# Altium project APPARATY.PrjPcb
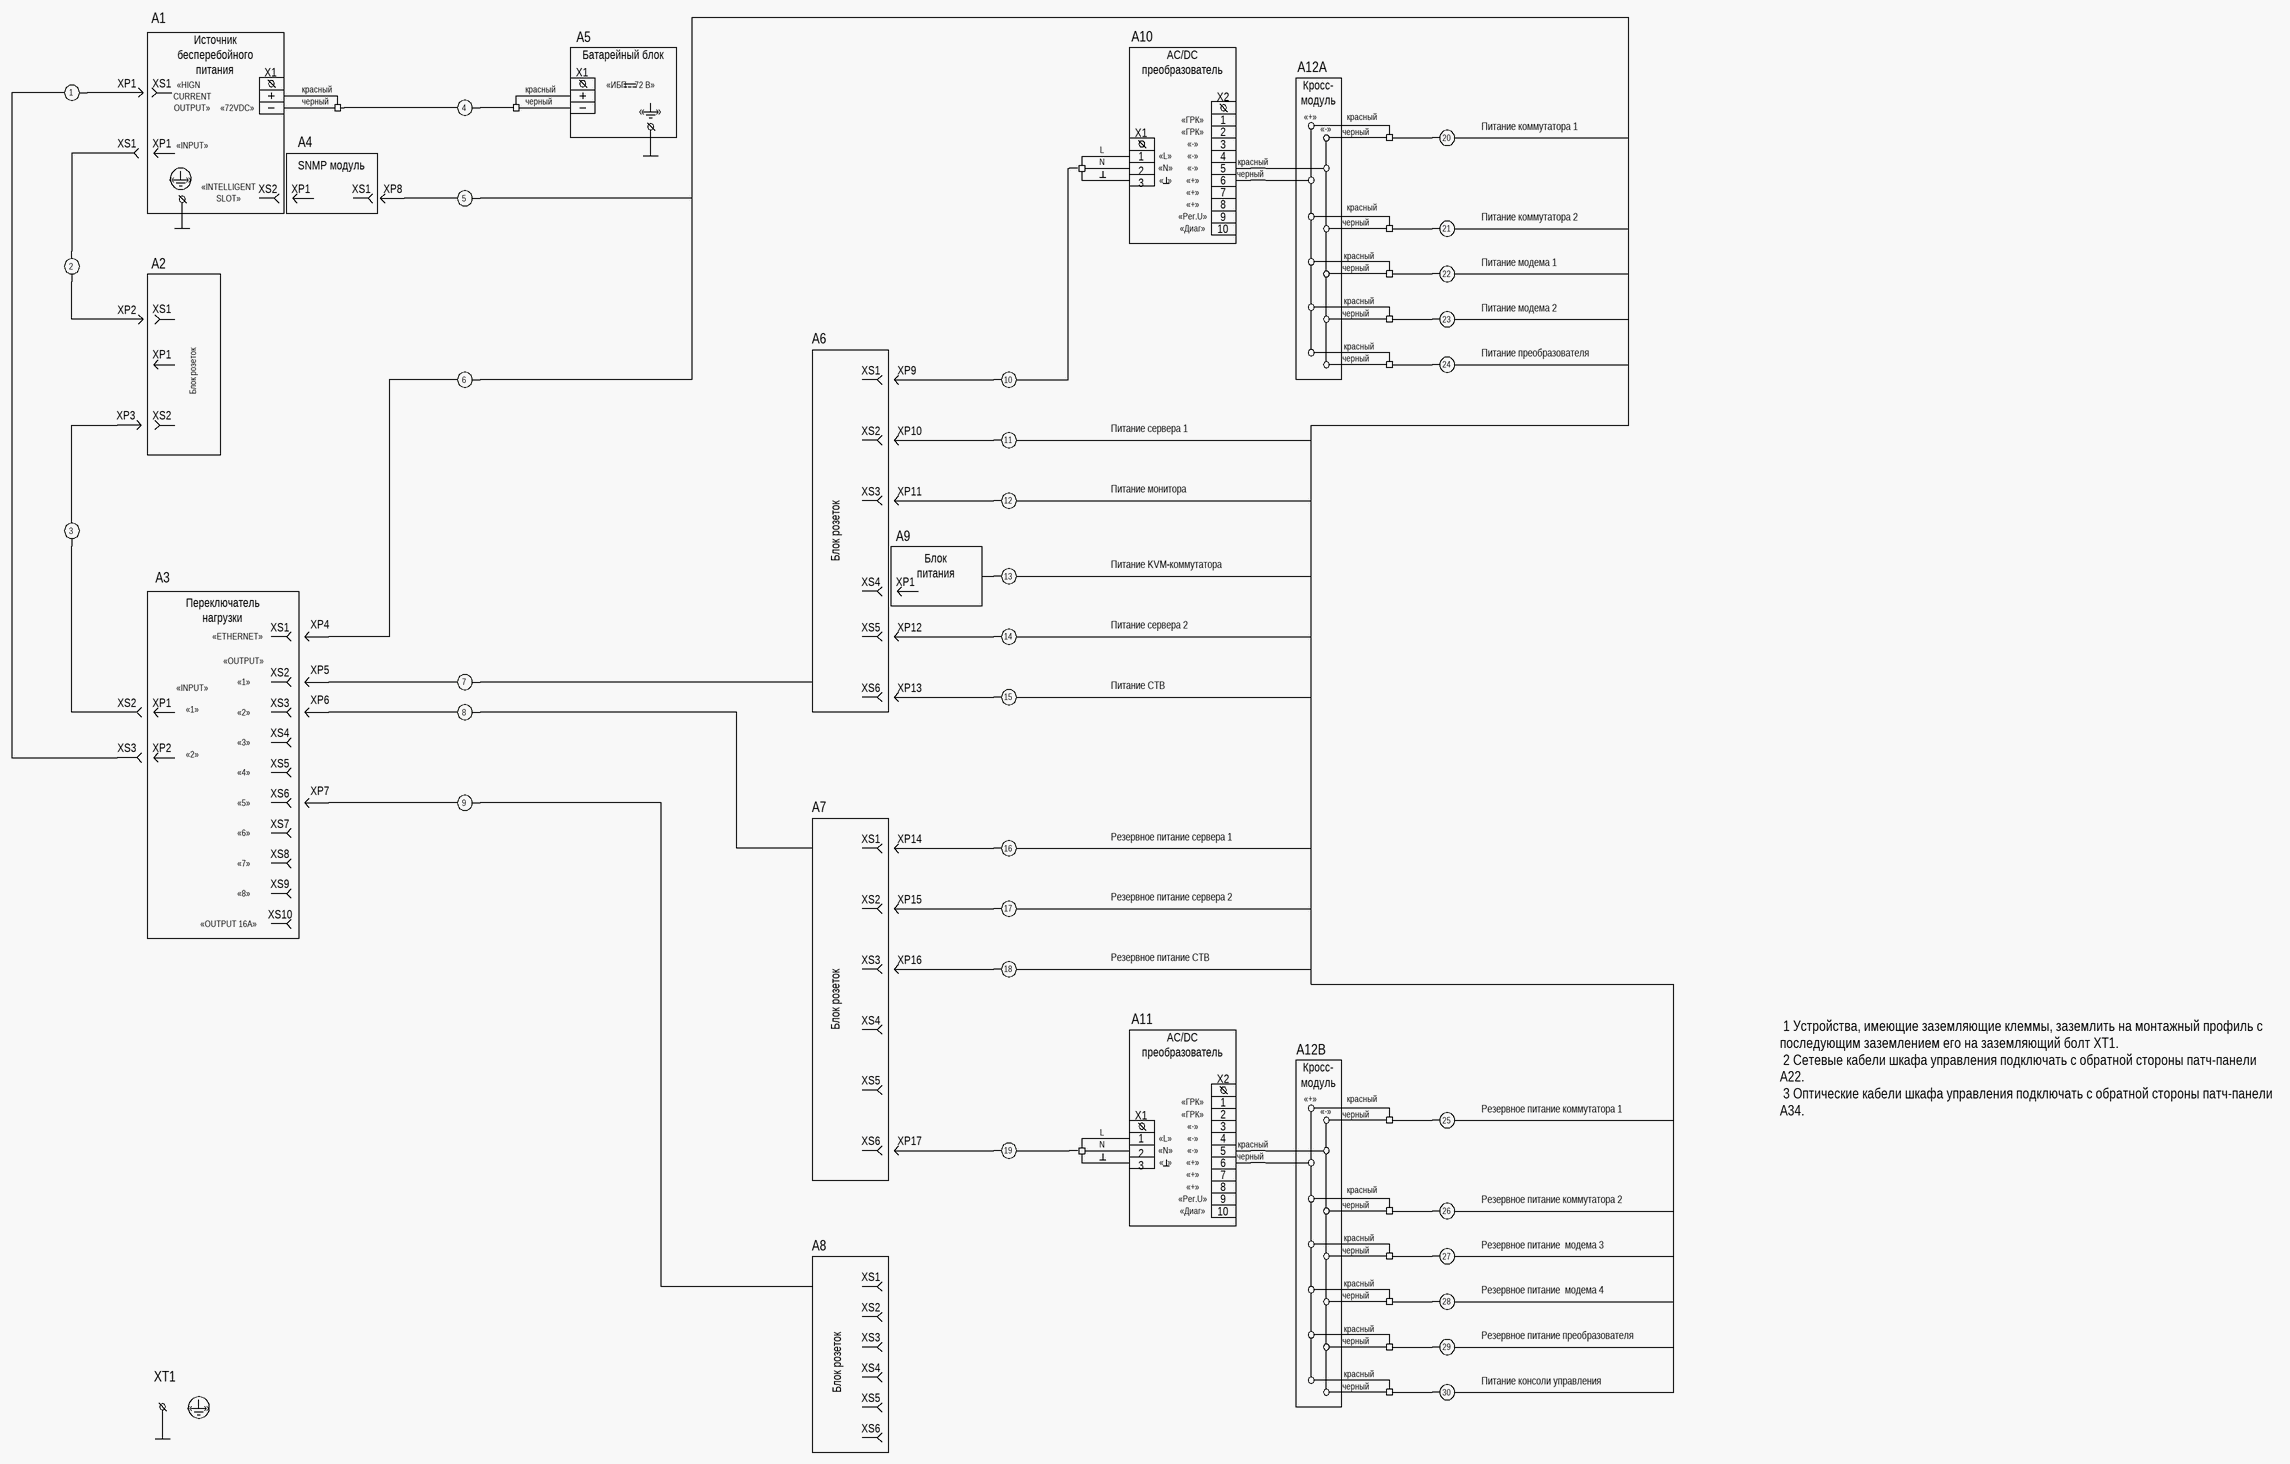
[diagram p0: Sheet1.SchDoc]
1 sheet, 63 parts. Net scope: global (net labels, ports and power ports of the same name join across sheets).

## Sheet Sheet1.SchDoc: Шкаф управления
size 840 x 594 mm; CheckedBy: Чарушин; Author: Морозов; DrawnBy: Абрамова; Engineer: Светлов; SheetNumber: 1; SheetTotal: 2; DecimalNumber: ТБИС.460800.002 Э4; Type_sh: принципиальная; Type_doc: Схема электрическая; Title2str: аппаратной (ШУА); DecimalNumber_eng: TBIS.ХХХХХХ.ХХХ; Litera: О; Primary_Applicability: Первичная применяемость

### Parts
1  CABLE  (value not drawn)
2  CABLE  (value not drawn)
3  CABLE  (value not drawn)
4  CABLE  (value not drawn)
5  CABLE  (value not drawn)
6  CABLE  (value not drawn)
7  CABLE  (value not drawn)
8  CABLE  (value not drawn)
9  CABLE  (value not drawn)
10  CABLE  (value not drawn)
11  CABLE  (value not drawn)
12  CABLE  (value not drawn)
13  CABLE  (value not drawn)
14  CABLE  (value not drawn)
15  CABLE  (value not drawn)
16  CABLE  (value not drawn)
17  CABLE  (value not drawn)
18  CABLE  (value not drawn)
19  CABLE  (value not drawn)
20  CABLE  (value not drawn)
21  CABLE  (value not drawn)
22  CABLE  (value not drawn)
23  CABLE  (value not drawn)
24  CABLE  (value not drawn)
25  CABLE  (value not drawn)
26  CABLE  (value not drawn)
27  CABLE  (value not drawn)
28  CABLE  (value not drawn)
29  CABLE  (value not drawn)
30  CABLE  (value not drawn)
A1  Источник бесперебойного питания SKAT-UPS 3000 RACK Бастион  (value not drawn)
A2  блок  (value not drawn)
A3  ПН  (value not drawn)
A4  SNMP_модуль  (value not drawn)
A5  бб  (value not drawn)
A6  БР2  (value not drawn)
A7  БР1  (value not drawn)
A8  БР3  (value not drawn)
A9  блок питания  (value not drawn)
A10  ACDC  (value not drawn)
A11  ACDC  (value not drawn)
A12  км  (value not drawn)  (parts A,B of 2)
XP1  XP  (value not drawn)
XP2  XP  (value not drawn)
XP3  XP  (value not drawn)
XP4  XP  (value not drawn)
XP5  XP  (value not drawn)
XP6  XP  (value not drawn)
XP7  XP  (value not drawn)
XP8  XP  (value not drawn)
XP9  XP  (value not drawn)
XP10  XP  (value not drawn)
XP11  XP  (value not drawn)
XP12  XP  (value not drawn)
XP13  XP  (value not drawn)
XP14  XP  (value not drawn)
XP15  XP  (value not drawn)
XP16  XP  (value not drawn)
XP17  XP  (value not drawn)
XS1  XS  (value not drawn)
XS2  XS  (value not drawn)
XS3  XS  (value not drawn)
XT1  GND  (value not drawn)

### Nets
Net1_4: 1.4(ANAIN2) XS3.6(ANAIN4)
Net1_5: 1.5(ANAIN3) XP1.6(ANAIN4)
Net2_4: 2.4(ANAIN2) XP2.6(ANAIN4)
Net2_5: 2.5(ANAIN3) XS1.6(ANAIN4)
Net3_4: 3.4(ANAIN2) XS2.6(ANAIN4)
Net3_5: 3.5(ANAIN3) XP3.6(ANAIN4)
Net4_4: 4.4(ANAIN2) A1.6(ANAIN4)
Net4_5: 4.5(ANAIN3) A5.6(ANAIN4)
Net5_4: 5.4(ANAIN2) XP8.6(ANAIN4)
Net6_4: 6.4(ANAIN2) XP4.6(ANAIN4)
Net7_4: 7.4(ANAIN2) XP5.6(ANAIN4)
Net7_5: 7.5(ANAIN3) A6.5(ANAIN3)
Net8_4: 8.4(ANAIN2) XP6.6(ANAIN4)
Net8_5: 8.5(ANAIN3) A7.5(ANAIN3)
Net9_4: 9.4(ANAIN2) XP7.6(ANAIN4)
Net9_5: 9.5(ANAIN3) A8.5(ANAIN3)
Net10_4: 10.4(ANAIN2) XP9.6(ANAIN4)
Net10_5: 10.5(ANAIN3) A10.5(ANAIN3)
Net11_4: 11.4(ANAIN2) XP10.6(ANAIN4)
Net12_4: 12.4(ANAIN2) XP11.6(ANAIN4)
Net13_4: 13.4(ANAIN2) A9.6(ANAIN4)
Net14_4: 14.4(ANAIN2) XP12.6(ANAIN4)
Net15_4: 15.4(ANAIN2) XP13.6(ANAIN4)
Net16_4: 16.4(ANAIN2) XP14.6(ANAIN4)
Net17_4: 17.4(ANAIN2) XP15.6(ANAIN4)
Net18_4: 18.4(ANAIN2) XP16.6(ANAIN4)
Net19_4: 19.4(ANAIN2) XP17.6(ANAIN4)
Net19_5: 19.5(ANAIN3) A11.5(ANAIN3)
Net20_4: 20.4(ANAIN2) A12.5(ANAIN3)
Net21_4: 21.4(ANAIN2) A12.6(ANAIN4)
Net22_4: 22.4(ANAIN2) A12.7(ANAIN5)
Net23_4: 23.4(ANAIN2) A12.8(ANAIN6)
Net24_4: 24.4(ANAIN2) A12.9(ANAIN7)
Net25_4: 25.4(ANAIN2) A12.5(ANAIN3)
Net26_4: 26.4(ANAIN2) A12.6(ANAIN4)
Net27_4: 27.4(ANAIN2) A12.7(ANAIN5)
Net28_4: 28.4(ANAIN2) A12.8(ANAIN6)
Net29_4: 29.4(ANAIN2) A12.9(ANAIN7)
Net30_4: 30.4(ANAIN2) A12.10(ANAIN8)
NetA10_6: A10.6(ANAIN4) A12.8(ANAIN6)
NetA10_7: A10.7(ANAIN5) A12.7(ANAIN5)
NetA11_6: A11.6(ANAIN4) A12.8(ANAIN6)
NetA11_7: A11.7(ANAIN5) A12.7(ANAIN5)

Not connected (* = marked no-connect by the designer): 5 5(ANAIN3); 6 5(ANAIN3); 11 5(ANAIN3); 12 5(ANAIN3); 13 5(ANAIN3); 14 5(ANAIN3); 15 5(ANAIN3); 16 5(ANAIN3); 17 5(ANAIN3); 18 5(ANAIN3); 20 5(ANAIN3); 21 5(ANAIN3); 22 5(ANAIN3); 23 5(ANAIN3); 24 5(ANAIN3); 25 5(ANAIN3); 26 5(ANAIN3); 27 5(ANAIN3); 28 5(ANAIN3); 29 5(ANAIN3); 30 5(ANAIN3)

### Notes on the sheet
- 1 Устройства, имеющие заземляющие клеммы, заземлить на монтажный профиль с последующим заземлением его на заземляющий болт XT1.
  2 Сетевые кабели шкафа управления подключать с обратной стороны патч-панели A22.
  3 Оптические кабели шкафа управления подключать с обратной стороны патч-панели A34.
- Labels drawn without touching a wire or pin: =DecimalNumber, Питание KVM-коммутатора, Питание коммутатора 1, Питание коммутатора 2, Питание консоли управления, Питание модема 1, Питание модема 2, Питание монитора, Питание преобразователя, Питание сервера 1, Питание сервера 2, Питание СТВ, Резервное питание  модема 3, Резервное питание  модема 4, Резервное питание коммутатора 1, Резервное питание коммутатора 2, Резервное питание преобразователя, Резервное питание сервера 1, Резервное питание сервера 2, Резервное питание СТВ
- Перв. примен.
- Справ. №
- Подпись и дата
- Инв. № дубл.
- Взам. инв. №
- Изм.
- Лист
- № докум.
- Подпись
- Дата
- Лит.
- Масса
- Масштаб
- Т. контр.
- Разраб.
- Провер.
- Листов
- Инв. № подл.
- Н. контр.
- Нач.сект.
- Утв.
- Копировал
- Формат А1
- (in symbol ACDC преобразователь) AC/DC; преобразователь; X2; «ГРК»; 1; X1; 2; «-»; 3; L; «L»; 4; N; красный; «N»; черный; «  »; «+»; 8; «Рег.U»; 9; «Диаг»; 10
- (in symbol GND) «    »
- (in symbol SNMP_модуль) SNMP модуль; XP1; XS1
- (in symbol атарейный блок) Батарейный блок; X1; «ИБП    72 В»; красный; черный; «    »
- (in symbol блок) XS1; XP1; Блок розеток; XS2
- (in symbol блок питания) Блок; XP1; питания
- (in symbol блок розеток 1) XS1; XS2; XS3; Блок розеток; XS4; XS5; XS6
- (in symbol блок розеток 2) XS1; XS2; XS3; Блок розеток; XS4; XS5; XS6
- (in symbol блок розеток 3) XS1; XS2; XS3; Блок розеток; XS4; XS5; XS6
- (in symbol Источник бесперебойного питания SKAT-UPS 3000 RACK Бастион) Источник; бесперебойного; X1; питания; XS1; «HIGN; красный; CURRENT; черный; OUTPUT»; «72VDC»; XP1; «INPUT»; «    »; XS2; «INTELLIGENT; SLOT»
- (in symbol кросс-модуль, part A) Кросс-; модуль; «+»; красный; «-»; черный
- (in symbol кросс-модуль, part B) Кросс-; модуль; «+»; красный; «-»; черный
- (in symbol Переключатель нагрузки) Переключатель; нагрузки; XS1; «ETHERNET»; «OUTPUT»; XS2; «1»; «INPUT»; XP1; XS3; «2»; XS4; XP2; «3»; XS5; «4»; XS6; «5»; XS7; «6»; XS8; «7»; XS9; «8»; XS10; «OUTPUT 16A»

### Library data of the parts
A3 = Переключатель нагрузки
A5 = атарейный блок
A6 = блок розеток 2
A7 = блок розеток 1
A8 = блок розеток 3
A10 A11 = ACDC преобразователь
A12 = кросс-модуль